# Altium schematic sheet RFID.SchDoc: RFID interface
size A4
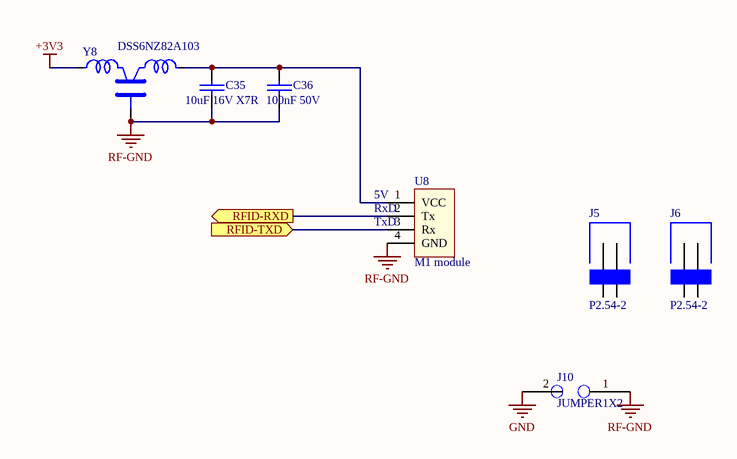
[diagram p0: RFID.SchDoc]

## Parts
C35  10uF 16V X7R  [CAPC3216N]
C36  100nF 50V  [CAPC2012N]
J5  P2.54-2  [JP2-P2.54]
J6  P2.54-2  [JP2-P2.54]
J10  JUMPER1X2  [JP-SOLDER-H1X2-3X2]  (no BOM)
U8  M1 module  [RFID_MOD]
Y8  DSS6NZ82A103  [DSS6]

## Ports
RFID-RXD (out), RFID-TXD (in)

## Nets
+3V3: Y8.1
GND: J10.2
RF-GND: C35.2 C36.2 J10.1 U8.4(GND) Y8.2
RFID-RXD: U8.2(Tx) ; port RFID-RXD
RFID-TXD: U8.3(Rx) ; port RFID-TXD
NetC35_1: C35.1 C36.1 U8.1(VCC) Y8.3

Not connected (* = marked no-connect by the designer): J5 1 2; J6 1 2

## Notes on the sheet
- (near U8) TxD
- (near U8) RxD
- (near U8) 5V

## Library data of the parts
C35 C36 = CAP: Price: 0.025
J5 J6 = JP2-2.54
U8 = RFID-M1: RFID module
Y8 = DSS6: Murata EMI suppression filter; Manufacturer: Murata; Price: 0.5